# Altium schematic sheet 01 - Main.SchDoc
size A4; Organization: Y Soft Corporation; Address1: U Knezske Louky 18; Address2: Praha 3; Address3: 13000; Address4: Czech Republic; PageSetup: Record=PageOptions|CenterHorizontal=True|CenterVertical=True|PrintScale=0.97|XCorrection=1.00|YCorrection=1.00|PrintKind=0|BorderSize=5000000|LeftOffset=0|BottomOffset=0|Orientation=2|PaperLength=1000|PaperWidth=1000|Scale=100|PaperSource=7|PrintQuality=-3|MediaType=1|DitherType=10|PrintScaleMode=1|PaperKind=A4|PaperIndex=9
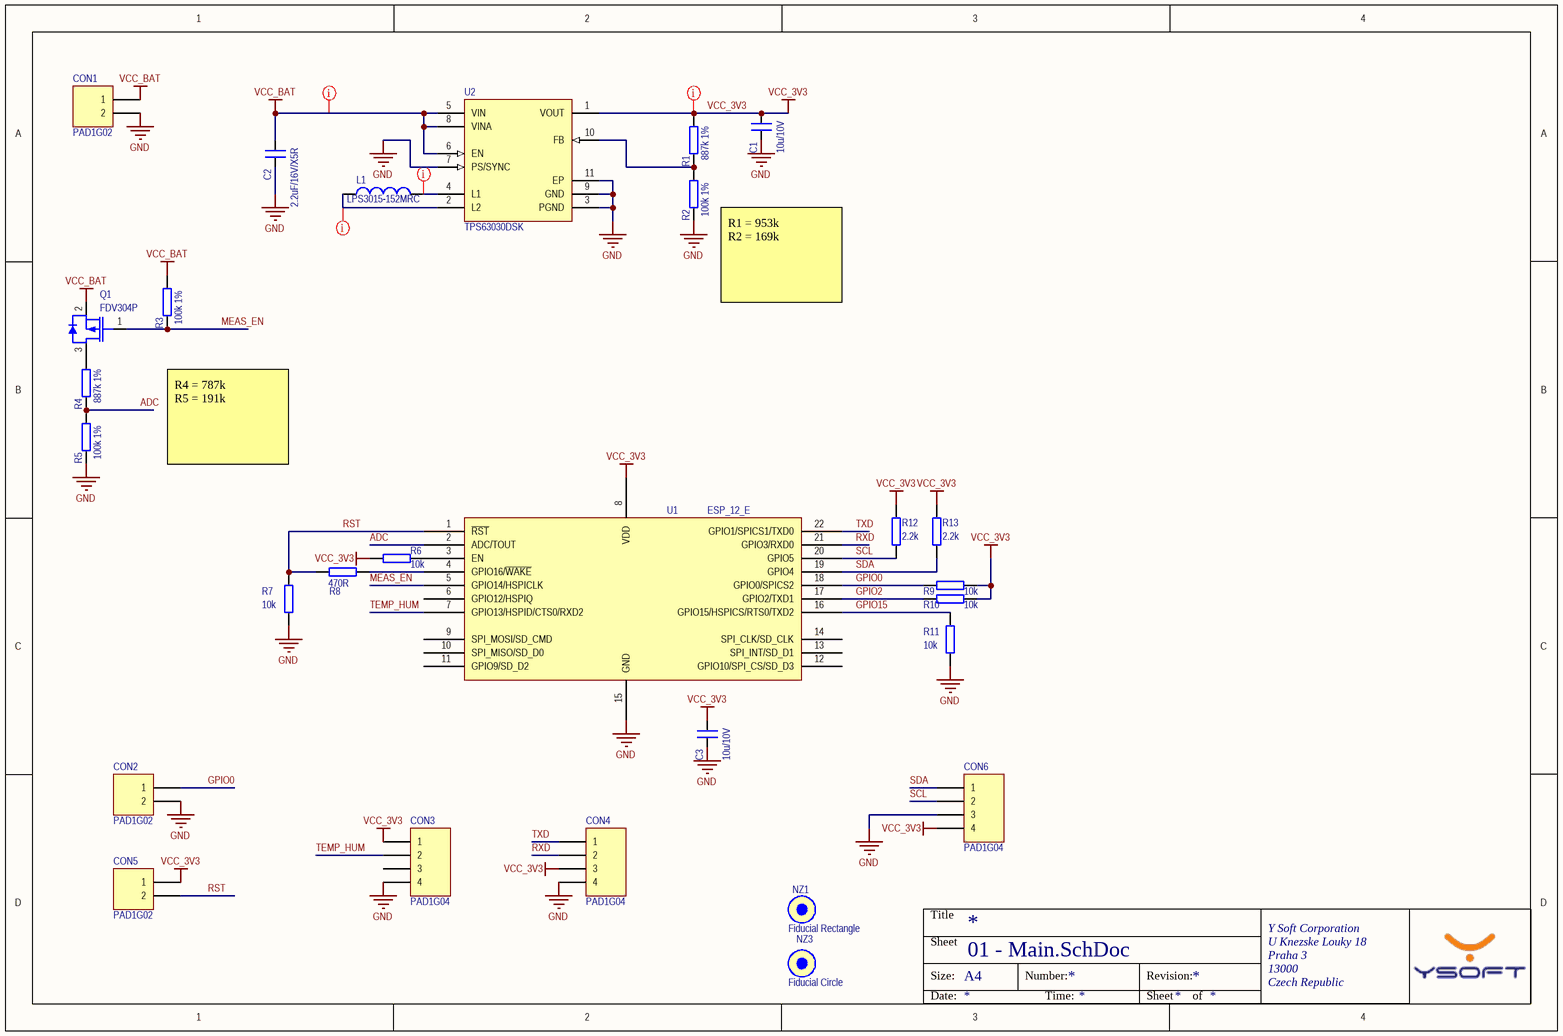
[diagram p0: 01 - Main.SchDoc]

## Parts
C1  10u/10V  [C-0805]
C2  2.2uF/16V/X5R  [C-0603]
C3  10u/10V  [C-0805]
CON1  PAD1G02  [HDR1X02S]
CON2  PAD1G02  [HDR1X02S]
CON3  PAD1G04  [HDR1X04S]
CON4  PAD1G04  [HDR1X04S]
CON5  PAD1G02  [HDR1X02S]
CON6  PAD1G04  [HDR1X04S]
L1  LPS3015-152MRC  [LPS3015]
NZ1  Fiducial Rectangle  [Fiducial Rectangle]  (no BOM)
NZ3  Fiducial Circle  [Fiducial Circle]  (no BOM)
Q1  FDV304P  [SOT23-3L]
R1  887k 1%  [R-0603]
R2  100k 1%  [R-0603]
R3  100k 1%  [R-0603]
R4  887k 1%  [R-0603]
R5  100k 1%  [R-0603]
R6  10k  [R-0603]
R7  10k  [R-0603]
R8  470R  [R-0603]
R9  10k  [R-0603]
R10  10k  [R-0603]
R11  10k  [R-0603]
R12  2.2k  [R-0603]
R13  2.2k  [R-0603]
U1  ESP_12_E  [ESP_12_E]
U2  TPS63030DSK  [DSK10-2000X1200TP_V]

## Nets
GND: C1.1 C2.1 C3.1 CON1.2 CON2.2 CON3.4 CON4.4 CON6.3 R2.1 R5.1 R7.1 R11.1 U1.15(GND) U2.3(PGND) U2.7(PS/SYNC) U2.9(GND) U2.11(EP)
VCC_3V3: C1.2 C3.2 CON3.1 CON4.3 CON5.1 CON6.4 R1.2 R6.2 R9.1 R10.1 R12.2 R13.2 U1.8(VDD) U2.1(VOUT)
VCC_BAT: C2.2 CON1.1 Q1.2(SOURCE) R3.2 U2.5(VIN) U2.6(EN) U2.8(VINA)
ADC: R4.1 R5.2 U1.2(ADC/TOUT)
GPIO0: CON2.1 R9.2 U1.18(GPIO0/SPICS2)
GPIO2: R10.2 U1.17(GPIO2/TXD1)
GPIO15: R11.2 U1.16(GPIO15/HSPICS/RTS0/TXD2)
MEAS_EN: Q1.1(GATE) R3.1 U1.5(GPIO14/HSPICLK)
RST: CON5.2 R7.2 R8.1 U1.1(~{RST})
RXD: CON4.2 U1.21(GPIO3/RXD0)
SCL: CON6.2 R12.1 U1.20(GPIO5)
SDA: CON6.1 R13.1 U1.19(GPIO4)
TEMP_HUM: CON3.2 U1.7(GPIO13/HSPID/CTS0/RXD2)
TXD: CON4.1 U1.22(GPIO1/SPICS1/TXD0)
NetL1_1: L1.1 U2.2(L2)
NetL1_2: L1.2 U2.4(L1)
NetQ1_3: Q1.3(DRAIN) R4.2
NetR1_1: R1.1 R2.2 U2.10(FB)
NetR6_1: R6.1 U1.3(EN)
NetR8_2: R8.2 U1.4(GPIO16/~{WAKE})

Not connected (* = marked no-connect by the designer): CON3 3; U1 6(GPIO12/HSPIQ) 9(SPI_MOSI/SD_CMD) 10(SPI_MISO/SD_D0) 11(GPIO9/SD_D2) 12(GPIO10/SPI_CS/SD_D3) 13(SPI_INT/SD_D1) 14(SPI_CLK/SD_CLK)

## Layout directives
net class Power Net: NetL1_1, NetL1_2, VCC_3V3, VCC_BAT

## Notes on the sheet
- (near R2) R1 = 953k
  R2 = 169k
- R4 = 787k
  R5 = 191k
- Title
- Size:
- Sheet
- A4
- Number:
- Revision:
- Date:
- Time:
- of

## Library data of the parts
C1 C3 = CMP-00295-1: SMD Ceramic Capacitor 0805 10u/10V; Helios ID: C-0805 10u/10V; Type: SMT; Package: 0805
C2 = CMP-00265-1: SMD Ceramic Capacitor 0603 2.2uF/16V/X5R; Helios ID: C-0603 2.2uF/16V/X5R; Type: SMT; Package: 0603
CON1 CON2 CON5 = CMP-00005-1: 1x2pin single row pads, 2.54mm; Helios ID: KON-PAD1G02; LatestRevisionDate: 17-Jul-2002; LatestRevisionNote: Re-released for DXP Platform.; Publisher: Altium Limited; Type: TH
CON3 CON4 CON6 = CMP-00006-3: 1x4pin single row pads, 2.54mm; Helios ID: KON-PAD1G04; Type: TH
L1 = CMP-00325-2: Shielded inductor 1.5uH/1.3A 3x3mm; Helios ID: TLU-LPS3015-152MRC; Type: SMT; HelpURL: \\DCCZPRAH01\Shared\R&D\Documents\Coilcraft\lps3015.pdf
NZ1 = CMP-00041-2: Helios ID: x004; Type: MECH
NZ3 = CMP-00042-3: Helios ID: x005; Type: MECH
Q1 = CMP-00186-2: P-Channel Digital FET 25V, 460mA; Helios ID: TRA-FDV304P; Type: SMT; Package: SOT23; HelpURL: http://www.fairchildsemi.com/ds/FD/FDV304P.pdf
R1 R4 = CMP-00324-1: SMD Resistor 0603 887k 1%; Helios ID: R-0603 887k 1%; Value: 887k; Type: SMT; Package: 0603
R2 R3 R5 = CMP-00033-2: SMD Resistor 0603 100k 1%; Helios ID: R-0603 100k 1%; Value: 100k; Type: SMT; Package: 0603
R6 R7 R9-R11 = CMP-00036-2: SMD Resistor 0603 10k; Helios ID: R-0603 10k; Value: 10k; Type: SMT; Package: 0603
R8 = CMP-00095-2: SMD Resistor 0603 470R; Value: 470; Helios ID: R-0603 470R; Type: SMT; Package: 0603
R12 R13 = CMP-00080-2: SMD Resistor 0603 2k2; Helios ID: R-0603 2k2; Value: 2.2k; Type: SMT; Package: 0603
U1 = ESP_12_E: ESP-12 Wi-Fi Module by AI-Thinker; IC: ESP8266-EX; Vendor: Ai-thinker
U2 = CMP-00323-3: High Efficient Single Inductor Buck-Boost Converter with 1-A Switches; Helios ID: IO-TPS63030DSKR; HelpURL: \\dcczprah01\Shared\R&D\Documents\Texas Instruments\tps63030.pdf; Package: PWSON10; Type: SMT